# EAGLE design SoundPlayer (EAGLE 6.5.0)
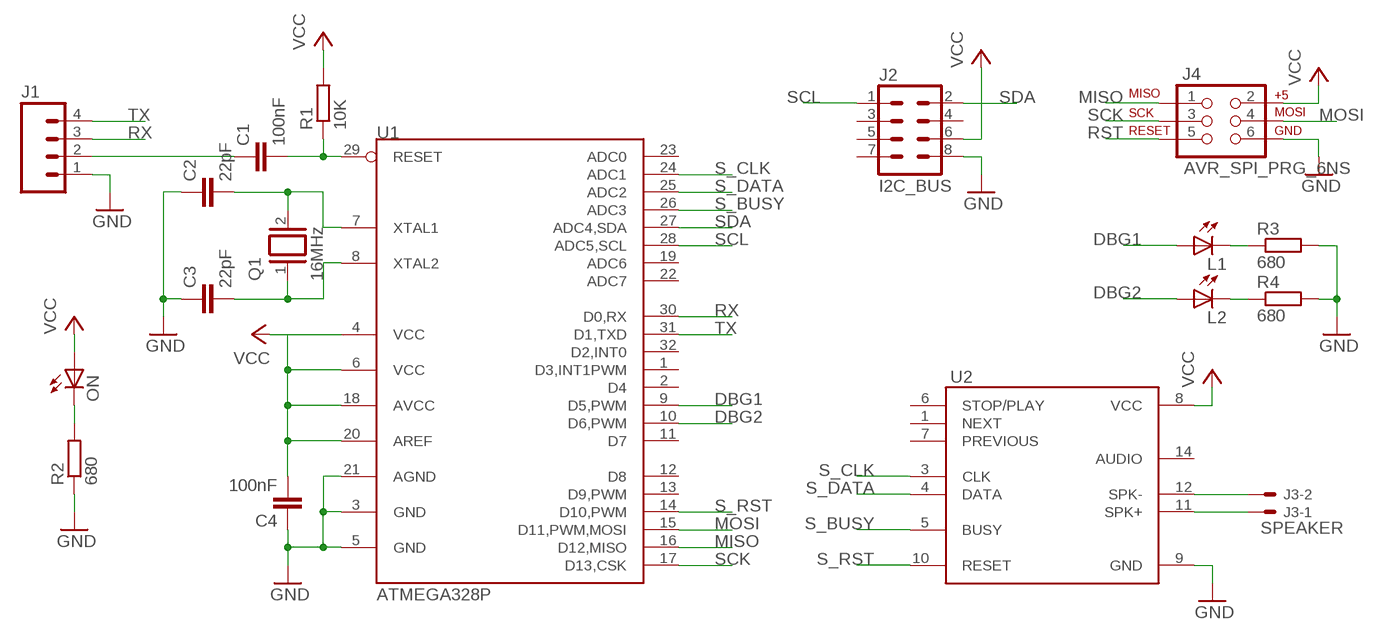
[diagram p0: schematic, sheet 1]

## Parts
C1  100nF  C-EUC0805  [C0805]
C2  22pF  C-EUC0805  [C0805]
C3  22pF  C-EUC0805  [C0805]
C4  100nF  C-EUC0805  [C0805]
J1  M04PTH  [1X04]
J2  I2C_BUS  IDC-SOCKET04X2IDC_SOCKECT04X2_ANGLE  [SOCKET04X2_ANGLE]
J3  SPEAKER  22-05-7028-02  [7395-02]
J4  AVR_SPI_PRG_6NS  [2X3-NS]
L1  LEDCHIPLED_0805  [CHIPLED_0805]
L2  LEDCHIPLED_0805  [CHIPLED_0805]
ON  LEDCHIPLED_0805  [CHIPLED_0805]
Q1  16MHz  XTAL/S  [QS]
R1  10K  R-EU_R0805  [R0805]
R2  680  R-EU_R0805  [R0805]
R3  680  R-EU_R0805  [R0805]
R4  680  R-EU_R0805  [R0805]
U1  ATMEGA328P  ATMEGA328-SMT  [TQFP32-08]
U2  SOMO-14D  [SOMO-14D]

## Nets
DBG1: L1.A U1.9(D5,PWM)
DBG2: L2.A U1.10(D6,PWM)
GND: C2.1 C3.1 C4.1 J1.1 J2.8 J4.6 R2.1 R3.2 R4.2 U1.3(GND) U1.5(GND) U1.21(AGND) U2.9(GND)
L2: L2.C R4.1
MISO: J4.1 U1.16(D12,MISO)
MOSI: J4.4 U1.15(D11,PWM,MOSI)
N$2: C1.1 J1.2
N$3: J3.2 U2.12(SPK-)
N$4: J3.1 U2.11(SPK+)
N$5: C2.2 Q1.2 U1.7(XTAL1)
N$6: C3.2 Q1.1 U1.8(XTAL2)
N$8: ON.C R2.2
N$13: L1.C R3.1
RST: C1.2 J4.5 R1.1 U1.29(RESET)
RX: J1.3 U1.30(D0,RX)
S_BUSY: U1.26(ADC3) U2.5(BUSY)
S_CLK: U1.24(ADC1) U2.3(CLK)
S_DATA: U1.25(ADC2) U2.4(DATA)
S_RST: U1.14(D10,PWM) U2.10(RESET)
SCK: J4.3 U1.17(D13,CSK)
SCL: J2.1 U1.28(ADC5,SCL)
SDA: J2.2 U1.27(ADC4,SDA)
TX: J1.4 U1.31(D1,TXD)
VCC: C4.2 J2.6 J4.2 ON.A R1.2 U1.4(VCC) U1.6(VCC) U1.18(AVCC) U1.20(AREF) U2.8(VCC)
Unconnected: J2.3 J2.4 J2.5 J2.7 U1.1(D3,INT1PWM) U1.2(D4) U1.11(D7) U1.12(D8) U1.13(D9,PWM) U1.19(ADC6) U1.22(ADC7) U1.23(ADC0) U1.32(D2,INT0) U2.1(NEXT) U2.6(STOP/PLAY) U2.7(PREVIOUS) U2.14(AUDIO)

## Library data of the parts
C1-C4 = rcl:C-EU: CAPACITOR, European symbol
J1 = SparkFun-Connectors:M04: Header 4 Standard 4-pin 0.1" header. Use with straight break away headers (SKU : PRT-00116), right angle break away headers (PRT-00553), swiss pins (PRT-00743), machine pins (PRT-00117), and female headers (PRT-00115). Molex polarized connector foot print use with SKU : PRT-08231 with associated crimp pins and housings. 1MM SMD Version SKU: PRT-10208
J2 = Connectors:IDC-SOCKET04X2
J3 = con-molex:22-?-02: CONNECTOR wire to board 2.54 mm (.1 inch) pitch header; OC_FARNELL: 9731601; OC_NEWARK: unknown
J4 = SparkFun-Connectors:AVR_SPI_PRG_6: AVR ISP 6 Pin This is the reduced ISP connector for AVR programming. Common on Arduino. This footprint will take up less PCB space and can be used with a 10-pin to 6-pin adapter such as SKU: BOB-08508
L1 L2 ON = led:LED: LED OSRAM: - CHIPLED LG R971, LG N971, LY N971, LG Q971, LY Q971, LO R971, LY R971 LH N974, LH R974 LS Q976, LO Q976, LY Q976 LO Q996 - Hyper CHIPLED LW Q18S LB Q993, LB Q99A, LB R99A - SideLED LS A670, LO A670, LY A670, LG A670, LP A670 LB A673, LV A673, LT A673, LW A673 LH A674 LY A675 LS A676, LA A676, LO A676, LY A676, LW A676 LS A679, LY A679, LG A679 - Hyper Micro SIDELED® LS Y876, LA Y876, LO Y876, LY Y876 LT Y87S - SmartLED LW L88C, LW L88S LB L89C, LB L89S, LG L890 LS L89K, LO L89K, LY L89K LS L896, LA L896, LO L896, LY L896 - TOPLED LS T670, LO T670, LY T670, LG T670, LP T670 LSG T670, LSP T670, LSY T670, LOP T670, LYG T670 LG T671, LOG T671, LSG T671 LB T673, LV T673, LT T673, LW T673 LH T674 LS T676, LA T676, LO T676, LY T676, LB T676, LH T676, LSB T676, LW T676 LB T67C, LV T67C, LT T67C, LS T67K, LO T67K, LY T67K, LW E67C LS E67B, LA E67B, LO E67B, LY E67B, LB E67C, LV E67C, LT E67C LW T67C LS T679, LY T679, LG T679 LS T770, LO T770, LY T770, LG T770, LP T770 LB T773, LV T773, LT T773, LW T773 LH T774 LS E675, LA E675, LY E675, LS T675 LS T776, LA T776, LO T776, LY T776, LB T776 LHGB T686 LT T68C, LB T68C - Hyper Mini TOPLED® LB M676 - Mini TOPLED Santana® LG M470 LS M47K, LO M47K, LY M47K Source: http://www.osram.convergy.de LUXEON: - LUMILED® LXK2-PW12-R00, LXK2-PW12-S00, LXK2-PW14-U00, LXK2-PW14-V00 LXK2-PM12-R00, LXK2-PM12-S00, LXK2-PM14-U00 LXK2-PE12-Q00, LXK2-PE12-R00, LXK2-PE12-S00, LXK2-PE14-T00, LXK2-PE14-U00 LXK2-PB12-K00, LXK2-PB12-L00, LXK2-PB12-M00, LXK2-PB14-N00, LXK2-PB14-P00, LXK2-PB14-Q00 LXK2-PR12-L00, LXK2-PR12-M00, LXK2-PR14-Q00, LXK2-PR14-R00 LXK2-PD12-Q00, LXK2-PD12-R00, LXK2-PD12-S00 LXK2-PH12-R00, LXK2-PH12-S00 LXK2-PL12-P00, LXK2-PL12-Q00, LXK2-PL12-R00 Source: www.luxeon.com KINGBRIGHT: KA-3528ASYC Source: www.kingbright.com
Q1 = special:XTAL/S: CRYSTAL
R1-R4 = rcl:R-EU_: RESISTOR, European symbol
U1 = Arduino:ATMEGA328-SMT: 32-Pin Atmega328 part Commonly used on Arduino compatible boards Available in QFP and QFN packages TQFP is IC-09069 QFN is non-stock; PROD_ID: IC-09069
U2 = 4D-Systems:SOMO-14D

## Board
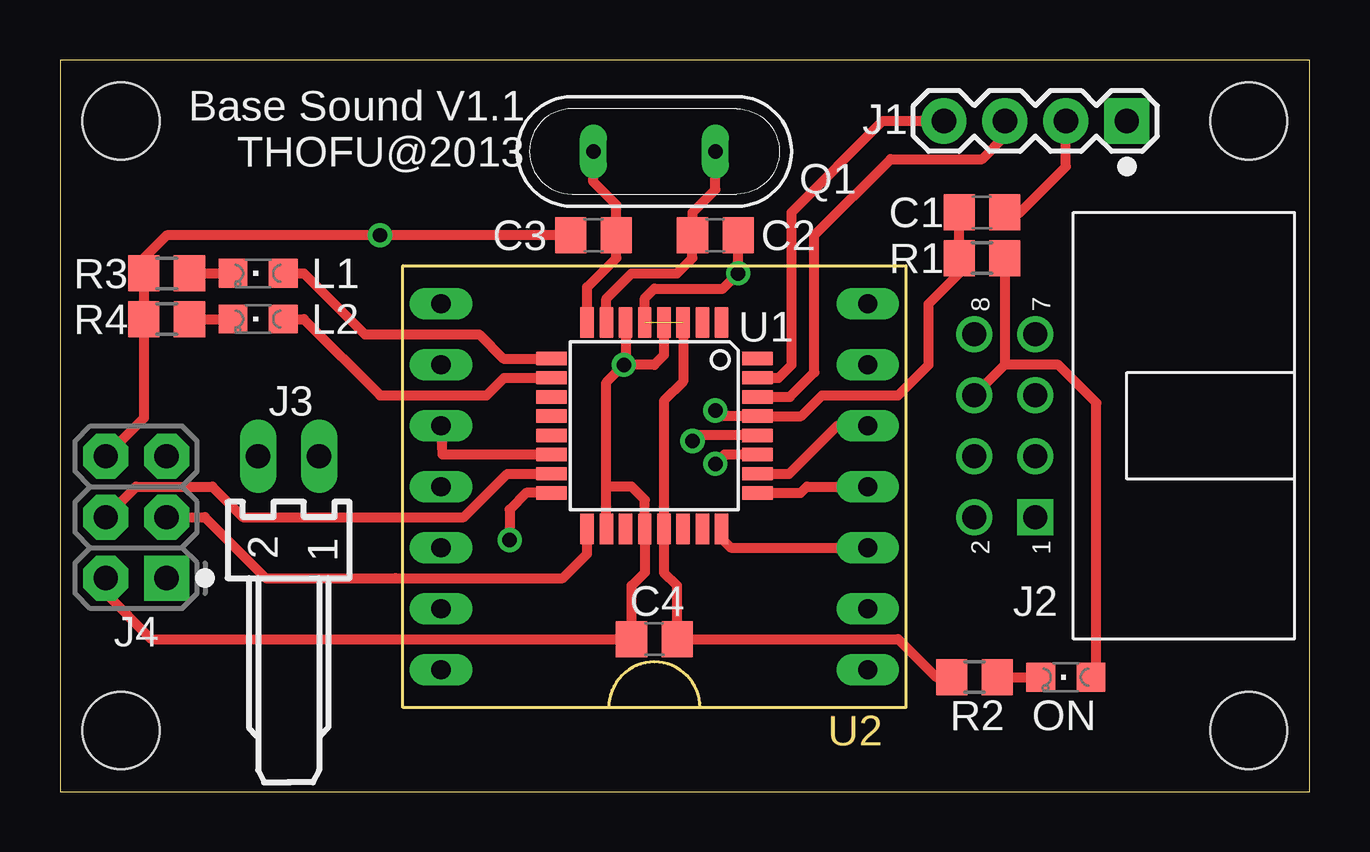
[diagram p1: board, top side]
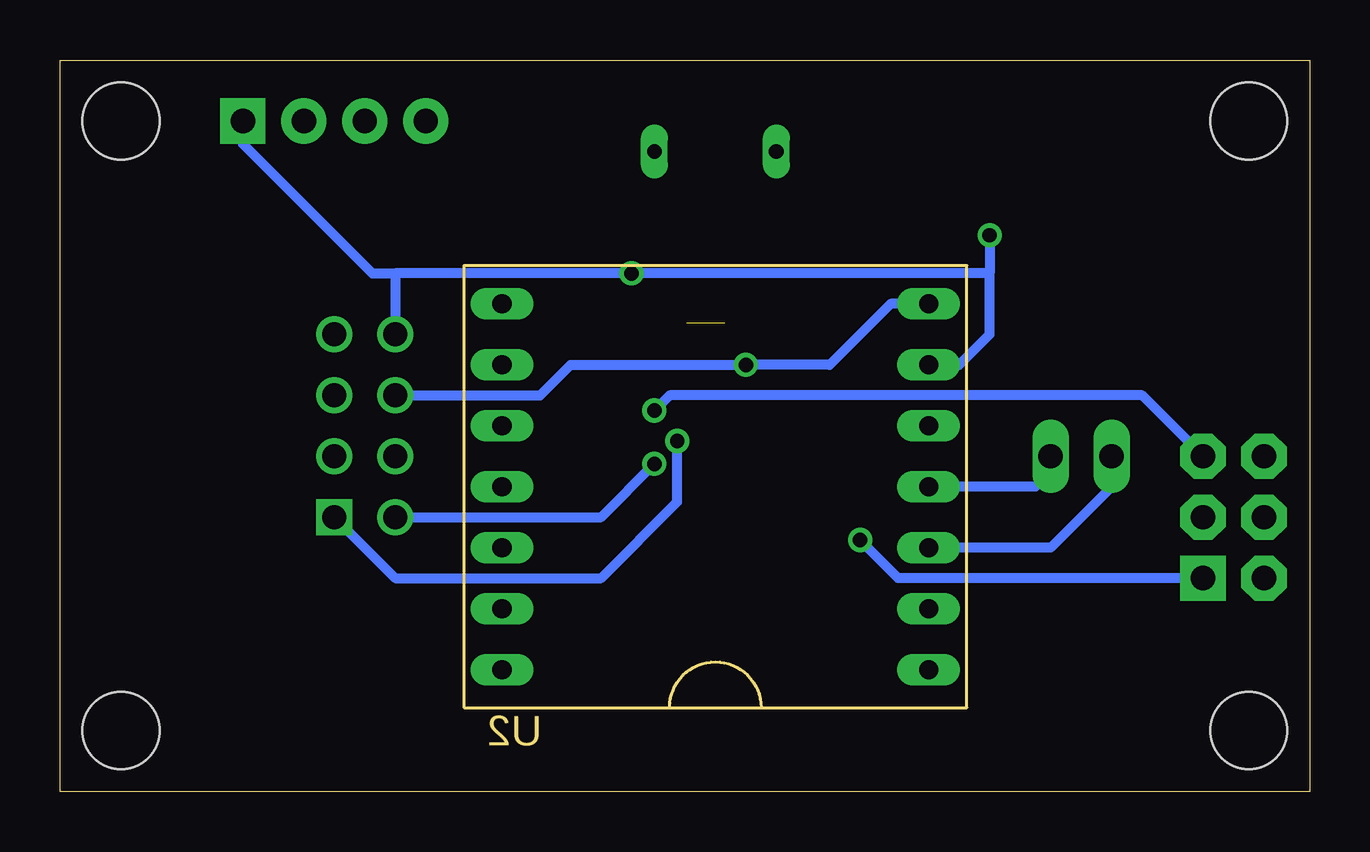
[diagram p2: board, bottom side, seen from below]

Size 52.07 x 30.48 mm. Coordinates in mm from the lower left corner, seen from the top.
Outline: 0,0 52.07,0 52.07,30.48 0,30.48 0,0
Copper layers (1*16): Top 0.035mm / dielectric 1.5mm / Bottom 0.035mm
Design rules "default": minimum track width 10mil, minimum drill 24mil, track to track 8mil, track to pad 8mil, pad to pad 8mil, via to via 8mil, smd to smd 8mil, copper to edge 40mil, drill to drill 8mil, minimum pad ring 10mil, minimum via ring 8mil, stop-mask expansion 4mil, vias tented up to drill 0mil, thermal gap 10mil
Holes 3.2 mm at 49.53,2.54 49.53,27.94 2.54,27.94 2.54,2.54

### Footprints (pad centres in the part's own frame; a part is rotated, then mirrored left to right if it is on the bottom)
C0805 = smd 1.3 x 1.5: 1 -0.95,0; 2 0.95,0
1X04 = drill 1.016 pad 1.88 square: 1 0,0 | drill 1.016 pad 1.88: 2 2.54,0; 3 5.08,0; 4 7.62,0
SOCKET04X2_ANGLE = drill 1 square: 1 -3.81,-1.27 | drill 1: 2 -3.81,1.27; 3 -1.27,-1.27; 4 -1.27,1.27; 5 1.27,-1.27; 6 1.27,1.27; 7 3.81,-1.27; 8 3.81,1.27
7395-02 = drill 1.016 long: 1 1.27,0; 2 -1.27,0
2X3-NS = drill 1.016 pad 1.88 square: 1 -2.54,-1.27 | drill 1.016 pad 1.88 octagon: 2 -2.54,1.27; 3 0,-1.27; 4 0,1.27; 5 2.54,-1.27; 6 2.54,1.27
CHIPLED_0805 = smd 1.2 x 1.2: A 0,-1.05; C 0,1.05
QS = drill 0.61 long: 1 -2.54,0; 2 2.54,0
R0805 = smd 1.3 x 1.5: 1 -0.95,0; 2 0.95,0
TQFP32-08 = smd 1.27 x 0.559: 1 -4.293,2.8; 2 -4.293,2; 3 -4.293,1.2; 4 -4.293,0.4; 5 -4.293,-0.4; 6 -4.293,-1.2; 7 -4.293,-2; 8 -4.293,-2.8; 17 4.293,-2.8; 18 4.293,-2; 19 4.293,-1.2; 20 4.293,-0.4; 21 4.293,0.4; 22 4.293,1.2; 23 4.293,2; 24 4.293,2.8 | smd 0.559 x 1.27: 9 -2.8,-4.293; 10 -2,-4.293; 11 -1.2,-4.293; 12 -0.4,-4.293; 13 0.4,-4.293; 14 1.2,-4.293; 15 2,-4.293; 16 2.8,-4.293; 25 2.8,4.293; 26 2,4.293; 27 1.2,4.293; 28 0.4,4.293; 29 -0.4,4.293; 30 -1.2,4.293; 31 -2,4.293; 32 -2.8,4.293
SOMO-14D = drill 0.8 long: 1 -8.89,7.62; 2 -8.89,5.08; 3 -8.89,2.54; 4 -8.89,0; 5 -8.89,-2.54; 6 -8.89,-5.08; 7 -8.89,-7.62; 8 8.89,-7.62; 9 8.89,-5.08; 10 8.89,-2.54; 11 8.89,0; 12 8.89,2.54; 13 8.89,5.08; 14 8.89,7.62

### Placement (x,y rotation side)
C1  38.42,24.13 180 top
C2  27.3,23.18 180 top
C3  22.23,23.18 0 top
C4  24.77,6.35 180 top
J1  44.45,27.94 180 top
J2  39.37,15.24 90 top
J3  9.53,13.97 0 top
J4  3.17,11.43 90 top
L1  8.26,21.59 90 top
L2  8.26,19.68 90 top
ON  41.91,4.76 90 top
Q1  24.77,26.67 0 top
R1  38.42,22.23 0 top
R2  38.1,4.76 0 top
R3  4.45,21.59 180 top
R4  4.45,19.68 180 top
U1  24.77,15.24 270 top
U2  24.77,12.7 180 top

### Tracks (layer width: path | path; a pad name or v marks a point on that pad's centre or on a via)
DBG1
  Top 0.406: L1.A 10.16,21.59 12.7,19.05 17.46,19.05 18.47,18.04 U1.9
DBG2
  Top 0.406: L2.A 10.16,19.68 13.34,16.51 17.78,16.51 18.51,17.24 U1.10
GND  (via drill 0.6)  (1 unrouted)
  Top 0.406: U1.3 25.96,17.07 25.16,16.27 U1.21 25.16,9.12 25.71,8.57 C4.1 26.03,6.35 26.04,6.35 34.92,6.35 36.51,4.76 R2.1 | J4.6 3.5,15.56 R4.2 R3.2 3.49,22.23 4.45,23.18 v13.34,23.18 C3.1 | U1.5 24.36,20.55 24.77,20.95 27.62,20.95 v28.26,21.59 C2.1
  Bottom 0.406: 38.1,21.59 v28.26,21.59 13.34,21.59 | 38.1,21.59 J2.8 | U2.9 14.61,17.78 13.34,19.05 13.34,21.59 | v13.34,23.18 13.34,21.59 | J1.1 44.45,26.99 39.05,21.59 38.1,21.59
L2
  Top 0.406: R4.1 L2.C
MISO  (via drill 0.6)
  Top 0.406: U1.16 19.43,12.44 18.73,11.75 v18.73,10.48
  Bottom 0.406: J4.1 17.14,8.89 v18.73,10.48
MOSI
  Top 0.406: J4.4 3.17,12.7 6.35,12.7 7.62,11.43 16.83,11.43 18.64,13.24 U1.15
N$2
  Top 0.406: C1.1 40.01,24.13 41.91,26.04 J1.2
N$3
  Bottom 0.406: J3.2 8.26,12.7 10.79,10.16 U2.12
N$4
  Bottom 0.406: J3.1 10.79,13.34 11.43,12.7 U2.11
N$5
  Top 0.406: Q1.2 27.3,25.08 26.36,24.13 C2.2 26.35,22.86 26.35,22.23 25.72,21.59 23.81,21.59 22.77,20.54 U1.7
N$6
  Top 0.406: Q1.1 22.23,25.4 23.18,24.45 23.18,22.86 C3.2 23.18,22.86 23.18,22.23 21.96,21.01 U1.8
N$8
  Top 0.406: R2.2 ON.C
N$13
  Top 0.406: R3.1 L1.C
RST  (via drill 0.6)
  Top 0.406: C1.2 R1.1 37.47,21.59 36.2,20.32 36.2,17.78 34.92,16.51 31.75,16.51 30.88,15.64 U1.29 27.54,15.64 v27.3,15.88
  Bottom 0.406: J4.5 6.99,16.51 26.67,16.51 v27.3,15.88
RX
  Top 0.406: U1.30 30.41,16.44 31.43,17.46 31.43,23.18 34.61,26.35 38.42,26.35 39.37,27.3 J1.3
S_BUSY
  Top 0.406: U1.26 30.39,13.24 32.38,15.24 U2.5
S_CLK
  Top 0.406: U1.24 27.57,10.54 27.94,10.16 U2.3
S_DATA
  Top 0.406: U1.25 30.86,12.44 31.11,12.7 U2.4
S_RST
  Top 0.406: U1.14 15.95,14.04 U2.10
SCK
  Top 0.406: U1.17 21.96,9.9 20.95,8.89 14.29,8.89 13.97,8.89 8.57,8.89 6.03,11.43 J4.3
SCL  (via drill 0.6)
  Top 0.406: U1.28 26.59,14.84 v26.35,14.61
  Bottom 0.406: J2.1 38.1,8.89 29.53,8.89 26.35,12.06 v26.35,14.61
SDA  (via drill 0.6)
  Top 0.406: U1.27 27.69,14.04 v27.3,13.65
  Bottom 0.406: J2.2 29.53,11.43 v27.3,13.65
TX
  Top 0.406: U1.31 29.94,17.24 30.48,17.78 30.48,24.13 34.29,27.94 J1.4
VCC  (via drill 0.6)
  Top 0.406: C4.2 23.82,8.57 24.36,9.12 U1.20 24.36,12.15 23.81,12.7 22.77,12.7 | R1.2 39.37,17.78 | 39.37,17.78 J2.6 | ON.A 43.18,5.3 43.18,16.19 41.59,17.78 39.37,17.78 | J4.2 1.91,8.26 3.81,6.35 23.18,6.35 C4.2 | C4.2 | U1.6 23.57,17.85 | 23.57,17.85 23.57,17.78 24.77,17.78 25.16,18.18 U1.4 | 23.57,17.85 v23.5,17.78 22.77,17.05 22.77,12.7 | U1.18 22.77,12.7
  Bottom 0.406: U2.8 17.46,20.32 20,17.78 v23.5,17.78 30.8,17.78 32.07,16.51 J2.6

### Text on the board
tNames: Base Sound V1.1 / THOFU@2013